# EAGLE schematic fan-faker (EAGLE 6.6.0)
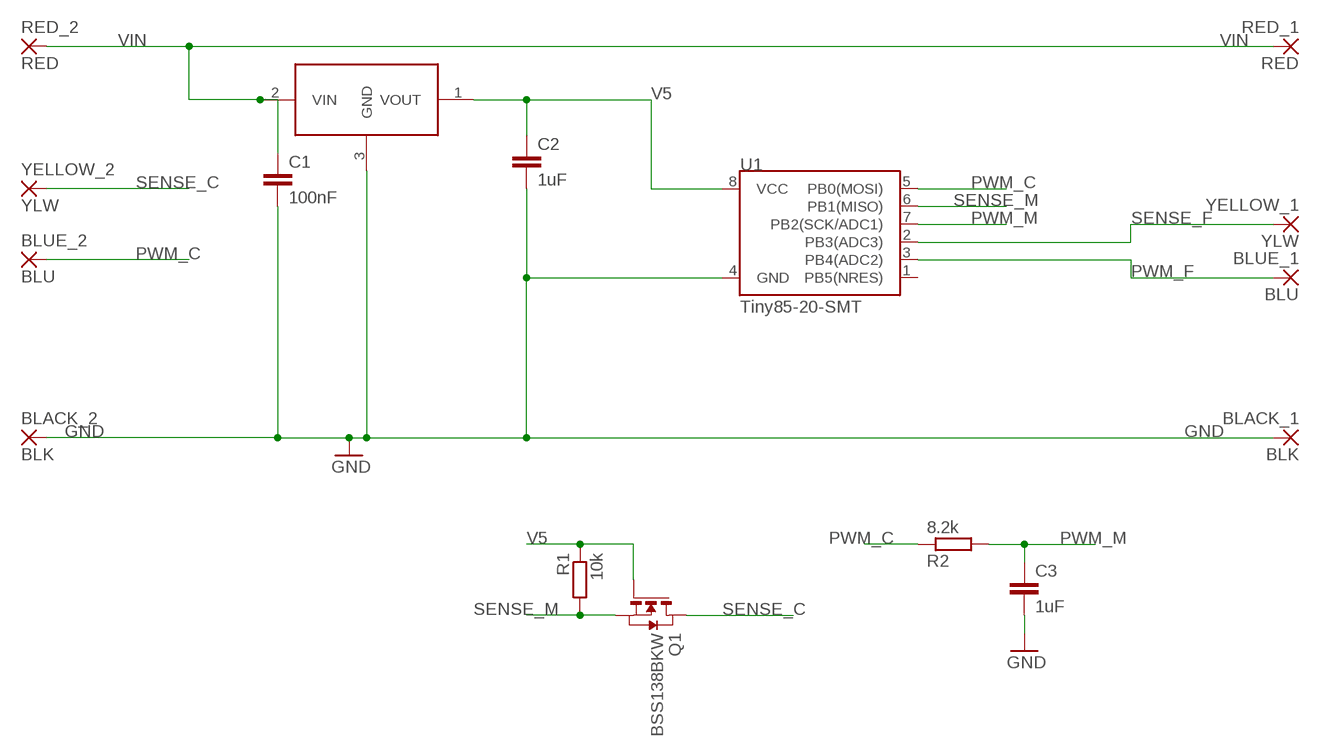
[diagram p0: schematic, sheet 1]

## Parts
BLACK_1  BLK  2,54/1,0  [2,54/1,0]
BLACK_2  BLK  2,54/1,0  [2,54/1,0]
BLUE_1  BLU  2,54/1,0  [2,54/1,0]
BLUE_2  BLU  2,54/1,0  [2,54/1,0]
C1  100nF  C-EUC0805K  [C0805K]
C2  1uF  C-EUC0805K  [C0805K]
C3  1uF  C-EUC0805K  [C0805K]
Q1  BSS138BKW  [SOT323]
R1  10k  R-EU_R0805  [R0805]
R2  8.2k  R-EU_R0805  [R0805]
RED_1  RED  2,54/1,0  [2,54/1,0]
RED_2  RED  2,54/1,0  [2,54/1,0]
U1  Tiny85-20-SMT  ATTINY45TINY85-20-SMT  [SO08-EIAJ]
U$2  LM3480  [SOT23]
YELLOW_1  YLW  2,54/1,0  [2,54/1,0]
YELLOW_2  YLW  2,54/1,0  [2,54/1,0]

## Nets
GND: BLACK_1.1(P) BLACK_2.1(P) C1.2 C2.2 C3.2 U1.4(GND) U$2.3(GND)
PWM_C: BLUE_2.1(P) R2.1 U1.5(PB0(MOSI))
PWM_F: BLUE_1.1(P) U1.3(PB4(ADC2))
PWM_M: C3.1 R2.2 U1.7(PB2(SCK/ADC1))
SENSE_C: Q1.1(D) YELLOW_2.1(P)
SENSE_F: U1.2(PB3(ADC3)) YELLOW_1.1(P)
SENSE_M: Q1.3(S) R1.2 U1.6(PB1(MISO))
V5: C2.1 Q1.2(G) R1.1 U1.8(VCC) U$2.1(VOUT)
VIN: C1.1 RED_1.1(P) RED_2.1(P) U$2.2(VIN)
Unconnected: U1.1(PB5(NRES))

## Library data of the parts
BLACK_1 BLACK_2 BLUE_1 BLUE_2 RED_1 RED_2 YELLOW_1 YELLOW_2 = wirepad:2,54/1,0: THROUGH-HOLE PAD
C1-C3 = rcl:C-EU: CAPACITOR, European symbol
Q1 = misc-user:BSS138BKW
R1 R2 = rcl:R-EU_: RESISTOR, European symbol
U1 = SparkFun-DigitalIC:ATTINY45: Atmel 8-pin 2/4/8kB flash uC; PROD_ID: IC-09092
U$2 = misc-user:LM3480